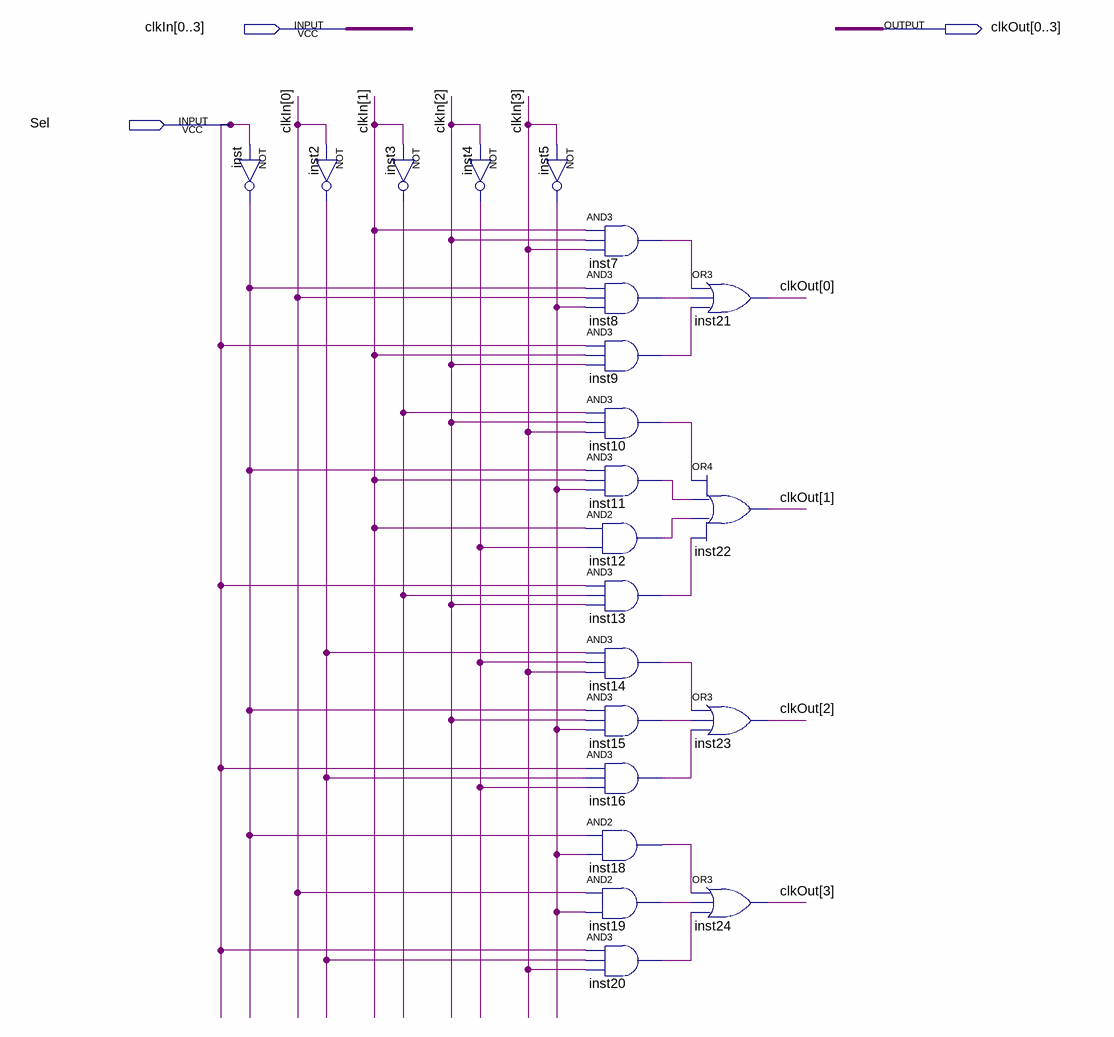
[diagram p0: schematic sheet]
// Quartus schematic clk_logic.bdf as structural Verilog: 22 symbols, 3 pins
module clk_logic (
  input  [0:3] clkIn,
  input  Sel,
  output [0:3] clkOut
);

  wire inst2_out, inst3_out, inst4_out, inst5_out, inst7_out, inst8_out, inst9_out, inst10_out, inst11_out,
       inst12_out, inst13_out, inst14_out, inst15_out, inst16_out, inst18_out, inst19_out, inst20_out,
       inst_out;

  not inst (inst_out, Sel);
  not inst2 (inst2_out, clkIn[0]);
  not inst3 (inst3_out, clkIn[1]);
  not inst4 (inst4_out, clkIn[2]);
  not inst5 (inst5_out, clkIn[3]);
  and inst7 (inst7_out, clkIn[1], clkIn[2], clkIn[3]);
  and inst8 (inst8_out, inst_out, clkIn[0], inst5_out);
  and inst9 (inst9_out, Sel, clkIn[1], clkIn[2]);
  and inst10 (inst10_out, inst3_out, clkIn[2], clkIn[3]);
  and inst11 (inst11_out, inst_out, clkIn[1], inst5_out);
  and inst12 (inst12_out, clkIn[1], inst4_out);
  and inst13 (inst13_out, Sel, inst3_out, clkIn[2]);
  and inst14 (inst14_out, inst2_out, inst4_out, clkIn[3]);
  and inst15 (inst15_out, inst_out, clkIn[2], inst5_out);
  and inst16 (inst16_out, Sel, inst2_out, inst4_out);
  and inst18 (inst18_out, inst_out, inst5_out);
  and inst19 (inst19_out, clkIn[0], inst5_out);
  and inst20 (inst20_out, Sel, inst2_out, clkIn[3]);
  or inst21 (clkOut[0], inst7_out, inst8_out, inst9_out);
  or inst22 (clkOut[1], inst10_out, inst11_out, inst12_out, inst13_out);
  or inst23 (clkOut[2], inst14_out, inst15_out, inst16_out);
  or inst24 (clkOut[3], inst18_out, inst19_out, inst20_out);
endmodule
